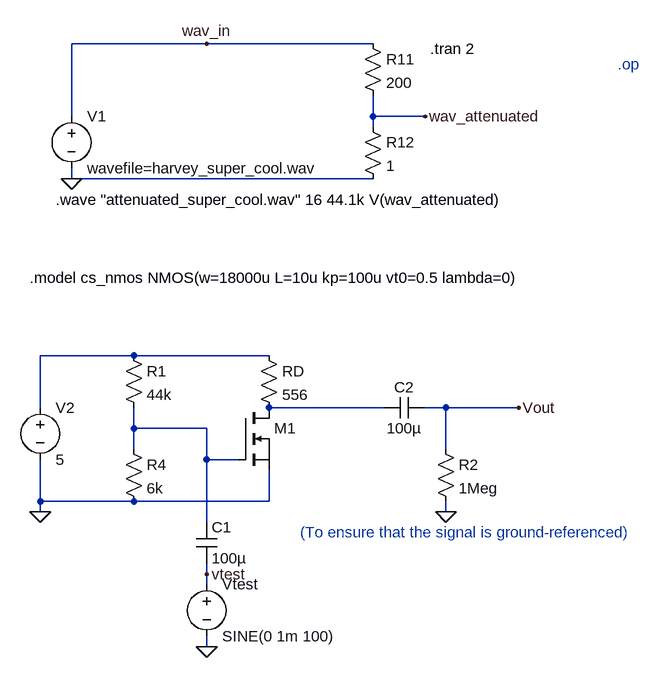
[diagram p0: schematic part_1_e.asc]
part_1_e.asc, the LTspice schematic file:
Version 4
SHEET 1 1372 900
WIRE 400 -48 192 -48
WIRE 656 -48 400 -48
WIRE 192 64 192 -48
WIRE 656 64 656 32
WIRE 736 64 656 64
WIRE 656 80 656 64
WIRE 192 160 192 144
WIRE 656 160 192 160
WIRE 288 432 144 432
WIRE 496 432 288 432
WIRE 144 512 144 432
WIRE 672 512 496 512
WIRE 768 512 736 512
WIRE 880 512 768 512
WIRE 288 544 288 512
WIRE 400 544 288 544
WIRE 288 576 288 544
WIRE 768 576 768 512
WIRE 400 592 400 544
WIRE 448 592 400 592
WIRE 144 656 144 592
WIRE 288 656 144 656
WIRE 496 656 496 608
WIRE 496 656 288 656
WIRE 144 672 144 656
WIRE 768 672 768 656
WIRE 400 688 400 592
WIRE 400 768 400 752
WIRE 400 784 400 768
WIRE 400 880 400 864
FLAG 400 -48 wav_in
FLAG 736 64 wav_attenuated
FLAG 192 160 0
FLAG 144 672 0
FLAG 880 512 Vout
FLAG 400 880 0
FLAG 768 672 0
FLAG 400 768 vtest
SYMBOL voltage 192 48 R0
SYMATTR InstName V1
SYMATTR Value wavefile=harvey_super_cool.wav
SYMBOL res 640 -64 R0
SYMATTR InstName R11
SYMATTR Value 200
SYMBOL res 640 64 R0
SYMATTR InstName R12
SYMATTR Value 1
SYMBOL nmos 448 512 R0
SYMATTR InstName M1
SYMATTR Value ""
SYMATTR SpiceModel cs_nmos
SYMBOL voltage 144 496 R0
WINDOW 123 0 0 Left 0
WINDOW 39 0 0 Left 0
SYMATTR InstName V2
SYMATTR Value 5
SYMBOL res 272 416 R0
SYMATTR InstName R1
SYMATTR Value 44k
SYMBOL res 272 560 R0
SYMATTR InstName R4
SYMATTR Value 6k
SYMBOL res 480 416 R0
SYMATTR InstName RD
SYMATTR Value 556
SYMBOL voltage 400 768 R0
WINDOW 123 0 0 Left 0
WINDOW 39 0 0 Left 0
SYMATTR InstName Vtest
SYMATTR Value SINE(0 1m 100)
SYMBOL cap 384 688 R0
SYMATTR InstName C1
SYMATTR Value 100µ
SYMBOL cap 736 496 R90
WINDOW 0 0 32 VBottom 2
WINDOW 3 32 32 VTop 2
SYMATTR InstName C2
SYMATTR Value 100µ
SYMBOL res 752 560 R0
SYMATTR InstName R2
SYMATTR Value 1Meg
TEXT 168 192 Left 2 !.wave "attenuated_super_cool.wav" 16 44.1k V(wav_attenuated)
TEXT 744 -40 Left 2 !.tran 2
TEXT 1032 -16 Left 2 ;.op
TEXT 128 312 Left 2 !.model cs_nmos NMOS(w=18000u L=10u kp=100u vt0=0.5 lambda=0)
TEXT 544 704 Left 2 ;(To ensure that the signal is ground-referenced)

The netlist it stands for:
* part_1_e.asc
V1 wav_in 0 wavefile=harvey_super_cool.wav
R11 wav_in wav_attenuated 200
R12 wav_attenuated 0 1
M1 N002 N003 0 0 cs_nmos
V2 N001 0 5
R1 N001 N003 44k
R4 N003 0 6k
RD N001 N002 556
Vtest vtest 0 SINE(0 1m 100)
C1 N003 vtest 100µ
C2 Vout N002 100µ
R2 Vout 0 1Meg
.model NMOS NMOS
.model PMOS PMOS
.lib standard.mos
.wave "attenuated_super_cool.wav" 16 44.1k V(wav_attenuated)
.tran 2
* .op
.model cs_nmos NMOS(w=18000u L=10u kp=100u vt0=0.5 lambda=0)
* (To ensure that the signal is ground-referenced)
.backanno
.end